# Altium schematic sheet W5500.SchDoc
size A4
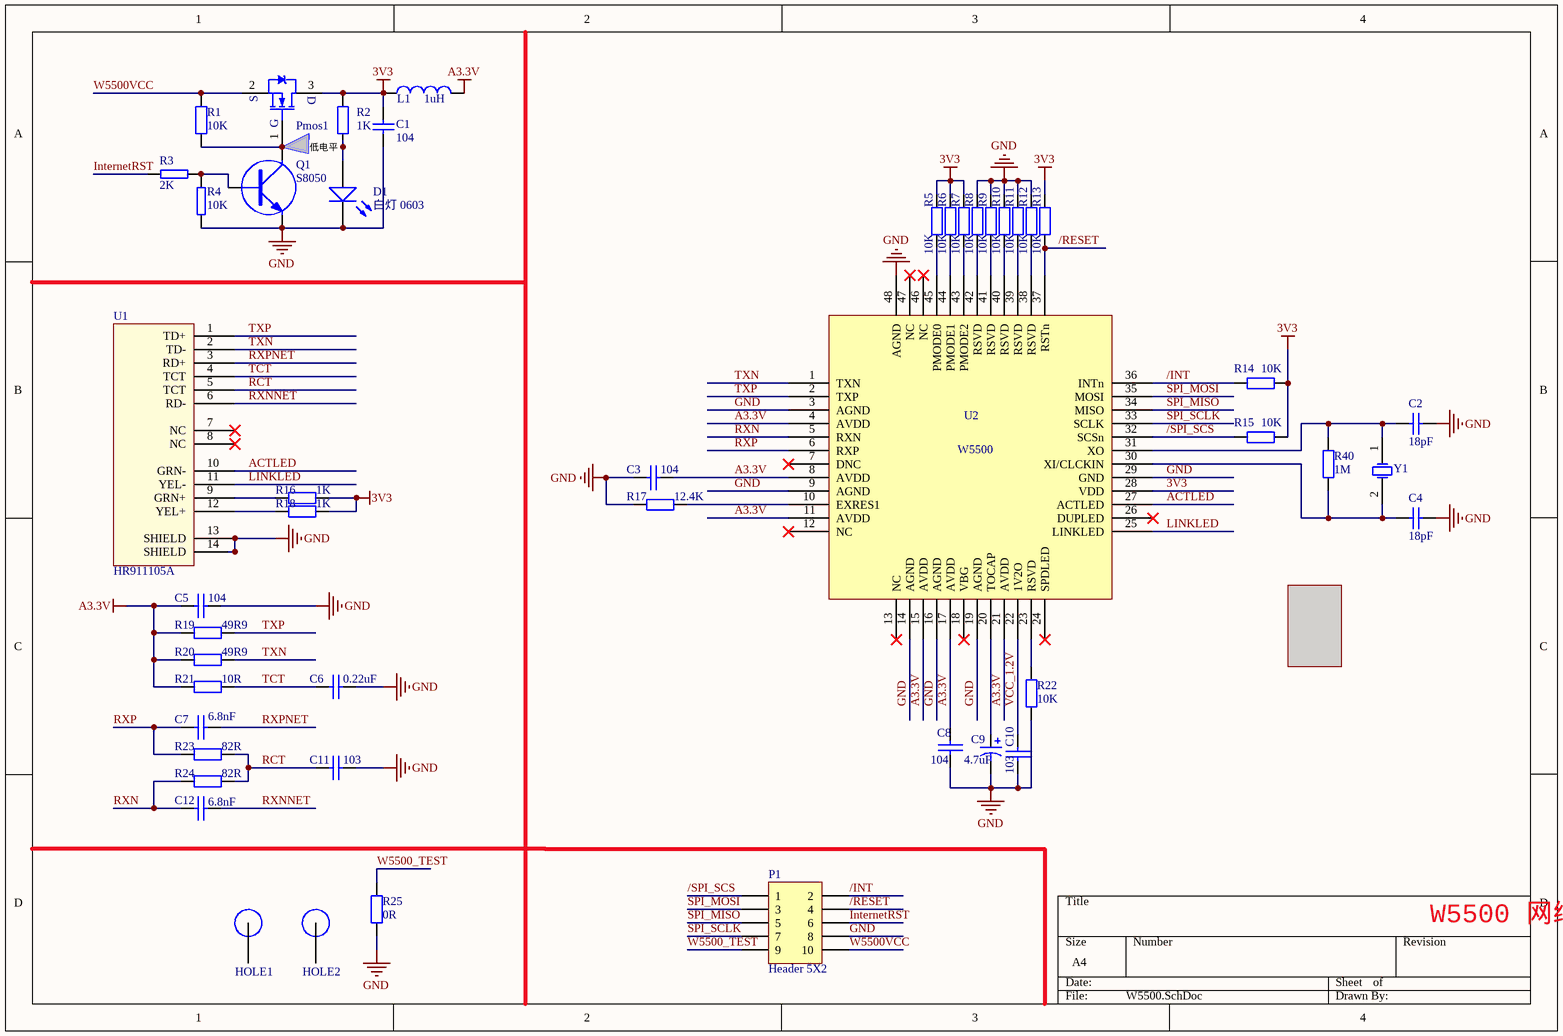
[diagram p0: W5500.SchDoc]

## Parts
C1  104  [LC-0603_C]
C2  18pF  [C0603]
C3  104  [C0603]
C4  18pF  [C0603]
C5  104  [C0603]
C6  0.22uF  [C0603]
C7  6.8nF  [C0603]
C8  104  [C0603]
C9  4.7uF  [C0603]
C10  103  [C0603]
C11  103  [C0603]
C12  6.8nF  [C0603]
D1  白灯 0603  [LC-0603_LED_S1]
HOLE1  HOLE  [H-3.2-3.2mm]  (value not drawn)
HOLE2  HOLE  [H-3.2-3.2mm]  (value not drawn)
L1  1uH  [LC-0805_L]
P1  Header 5X2  [F2.54-2*5]
Pmos1  SI2301  [LC-SOT-23(SOT-23-3)]  (value not drawn)
Q1  S8050  [LC-SOT-23(SOT-23-3)]
R1  10K  [LC-0603_R]
R2  1K  [LC-0603_R]
R3  2K  [LC-0603_R]
R4  10K  [LC-0603_R]
R5  10K  [R0603]
R6  10K  [R0603]
R7  10K  [R0603]
R8  10K  [R0603]
R9  10K  [R0603]
R10  10K  [R0603]
R11  10K  [R0603]
R12  10K  [R0603]
R13  10K  [R0603]
R14  10K  [R0603]
R15  10K  [R0603]
R16  1K  [R0603]
R17  12.4K  [R0603]
R18  1K  [R0603]
R19  49R9  [R0603]
R20  49R9  [R0603]
R21  10R  [R0603]
R22  10K  [R0603]
R23  82R  [R0603]
R24  82R  [R0603]
R25  0R  [R0603]
R40  1M  [0603-1]
U1  HR911105A  [HR911105A]
U2  W5500  [LQFP48]
Y1  25MHz  [LC-SMD-5032_2P]  (value not drawn)

## Nets
3V3: C1.2 L1.1 Pmos1.3(D) R2.2 R5.1 R6.1 R7.1 R13.1 R14.1 R15.1 R16.2 R18.2 U2.28(VDD)
A3.3V: C3.2 C5.2 C8.1 L1.2 R19.1 R20.1 R21.1 U2.4(AVDD) U2.8(AVDD) U2.11(AVDD) U2.15(AVDD) U2.17(AVDD) U2.21(AVDD)
GND: C1.1 C2.1 C3.1 C4.1 C5.1 C6.2 C8.2 C9.2 C10.2 C11.1 D1.K P1.8 Q1.2 R4.1 R8.1 R9.1 R10.1 R11.1 R12.1 R17.2 R22.2 R25.1 U1.13(SHIELD) U1.14(SHIELD) U2.3(AGND) U2.9(AGND) U2.14(AGND) U2.16(AGND) U2.19(AGND) U2.29(GND) U2.48(AGND)
/INT: P1.2 R14.2 U2.36(INTn)
/RESET: P1.4 R13.2 U2.37(RSTn)
/SPI_SCS: P1.1 R15.2 U2.32(SCSn)
ACTLED: U1.10(GRN-) U2.27(ACTLED)
InternetRST: P1.6 R3.2
LINKLED: U1.11(YEL-) U2.25(LINKLED)
RCT: C11.2 R23.2 R24.2 U1.5(TCT)
RXN: C12.1 R24.1 U2.5(RXN)
RXNNET: C12.2 U1.6(RD-)
RXP: C7.1 R23.1 U2.6(RXP)
RXPNET: C7.2 U1.3(RD+)
SPI_MISO: P1.5 U2.34(MISO)
SPI_MOSI: P1.3 U2.35(MOSI)
SPI_SCLK: P1.7 U2.33(SCLK)
TCT: C6.1 R21.2 U1.4(TCT)
TXN: R20.2 U1.2(TD-) U2.1(TXN)
TXP: R19.2 U1.1(TD+) U2.2(TXP)
VCC_1.2V: C10.1 U2.22(1V2O)
W5500_TEST: P1.9 R25.2
W5500VCC: P1.10 Pmos1.2(S) R1.2
NetC2_2: C2.2 R40.2 U2.31(XO) Y1.1(OSC1)
NetC4_2: C4.2 R40.1 U2.30(XI/CLCKIN) Y1.2(OSC2)
NetC9_1: C9.1 U2.20(TOCAP)
NetD1_A: D1.A R2.1
NetPmos1_1: Pmos1.1(G) Q1.3 R1.1
NetQ1_1: Q1.1 R3.1 R4.2
NetR5_2: R5.2 U2.45(PMODE0)
NetR6_2: R6.2 U2.44(PMODE1)
NetR7_2: R7.2 U2.43(PMODE2)
NetR8_2: R8.2 U2.42(RSVD)
NetR9_2: R9.2 U2.41(RSVD)
NetR10_2: R10.2 U2.40(RSVD)
NetR11_2: R11.2 U2.39(RSVD)
NetR12_2: R12.2 U2.38(RSVD)
NetR16_1: R16.1 U1.9(GRN+)
NetR17_1: R17.1 U2.10(EXRES1)
NetR18_1: R18.1 U1.12(YEL+)
NetR22_1: R22.1 U2.23(RSVD)

Not connected (* = marked no-connect by the designer): HOLE1 1; HOLE2 1; U1 7(NC)* 8(NC)*; U2 7(DNC)* 12(NC)* 13(NC)* 18(VBG)* 24(SPDLED)* 26(DUPLED)* 46(NC)* 47(NC)*

## Notes on the sheet
- (near R2) 低电平
- W5500 网络通信模块

## Library data of the parts
C1 C2 C4 = Cap: Capacitor; Published: 8-Jun-2000; LatestRevisionDate: 17-Jul-2002; LatestRevisionNote: Re-released for DXP Platform.; PackageReference: RAD-0.3; Publisher: Altium Limited
  C1: Value: 104
  C2 C4: Value: 18pF
C3 C5-C8 C10-C12 = CAP: Capacitor
C9 = Cap Pol3: Polarized Capacitor (Surface Mount); Published: 8-Jun-2000; LatestRevisionDate: 17-Jul-2002; LatestRevisionNote: Re-released for DXP Platform.; PackageReference: C0805; Publisher: Altium Limited; Value: 4.7uF
D1 = 0603 白灯: 发光二极管; ComponentLink1Description: 供应商链接; ComponentLink1URL: http://www.szlcsc.com/product/details_2663.html; Package: 0603; Supplier: LC; SuppliersPartNumber: C2290
L1 = Inductor: Code_IEC: 1005; Published: 8-Jun-2000; LatestRevisionDate: 17-Jul-2002; LatestRevisionNote: Re-released for DXP Platform.; PackageReference: 0402-A; Publisher: Altium Limited; Code_JEITA: 0402; Value: 1uH
P1 = Header 5X2: Header, 5-Pin, Dual row; LatestRevisionDate: 17-Jul-2002; LatestRevisionNote: Re-released for DXP Platform.; Publisher: Altium Limited
Pmos1 = N-MO
Q1 = NPN
R1 R2 R5-R16 R18 R21-R24 R40 = Res2: Resistor; Published: 8-Jun-2000; LatestRevisionDate: 17-Jul-2002; LatestRevisionNote: Re-released for DXP Platform.; PackageReference: AXIAL-0.4; Publisher: Altium Limited
  R1 R5-R15 R22: Value: 10K
  R2 R16 R18: Value: 1K
  R21: Value: 10R
  R23 R24: Value: 82R
  R40: Value: 1M
R3 R4 = RES
R17 = Res2: Resistor; Value: 12.4K 1%; Published: 8-Jun-2000; LatestRevisionDate: 17-Jul-2002; LatestRevisionNote: Re-released for DXP Platform.; PackageReference: AXIAL-0.4; Publisher: Altium Limited
R19 R20 = Res2: Resistor; Value: 49.9R; Published: 8-Jun-2000; LatestRevisionDate: 17-Jul-2002; LatestRevisionNote: Re-released for DXP Platform.; PackageReference: AXIAL-0.4; Publisher: Altium Limited
R25 = Res2: Resistor; Value: 82R; Published: 8-Jun-2000; LatestRevisionDate: 17-Jul-2002; LatestRevisionNote: Re-released for DXP Platform.; PackageReference: AXIAL-0.4; Publisher: Altium Limited
U2 = W5500: W5500以太网芯片
Y1 = XTAL: Crystal Oscillator; Published: 8-Jun-2000; LatestRevisionDate: 17-Jul-2002; LatestRevisionNote: Re-released for DXP Platform.; PackageReference: R38; Publisher: Altium Limited